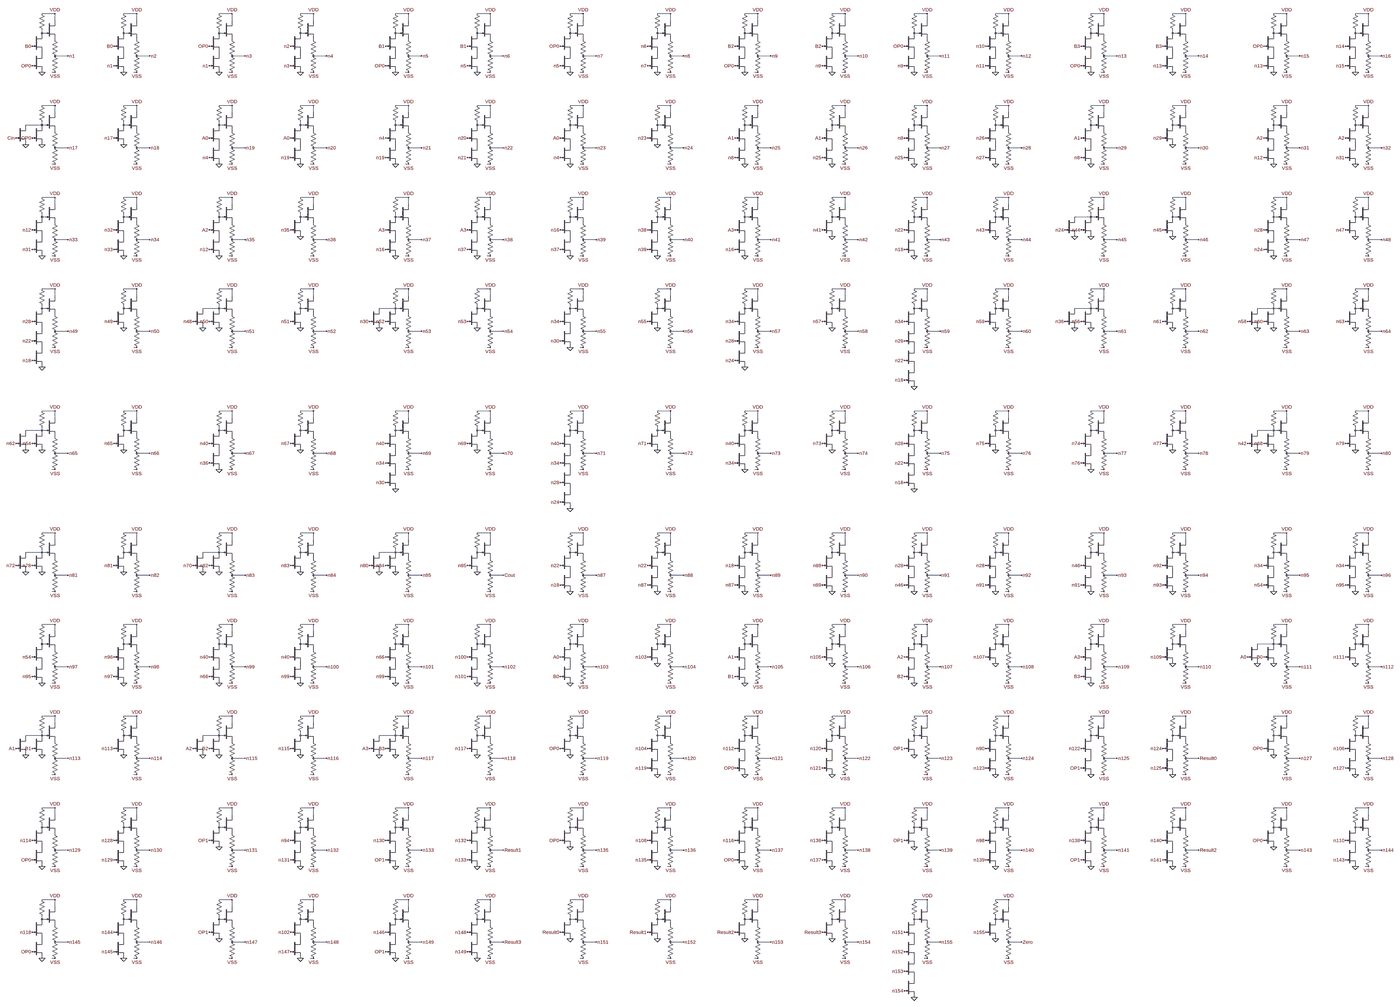
[diagram p0: schematic alu_4bit.asc, whole sheet]
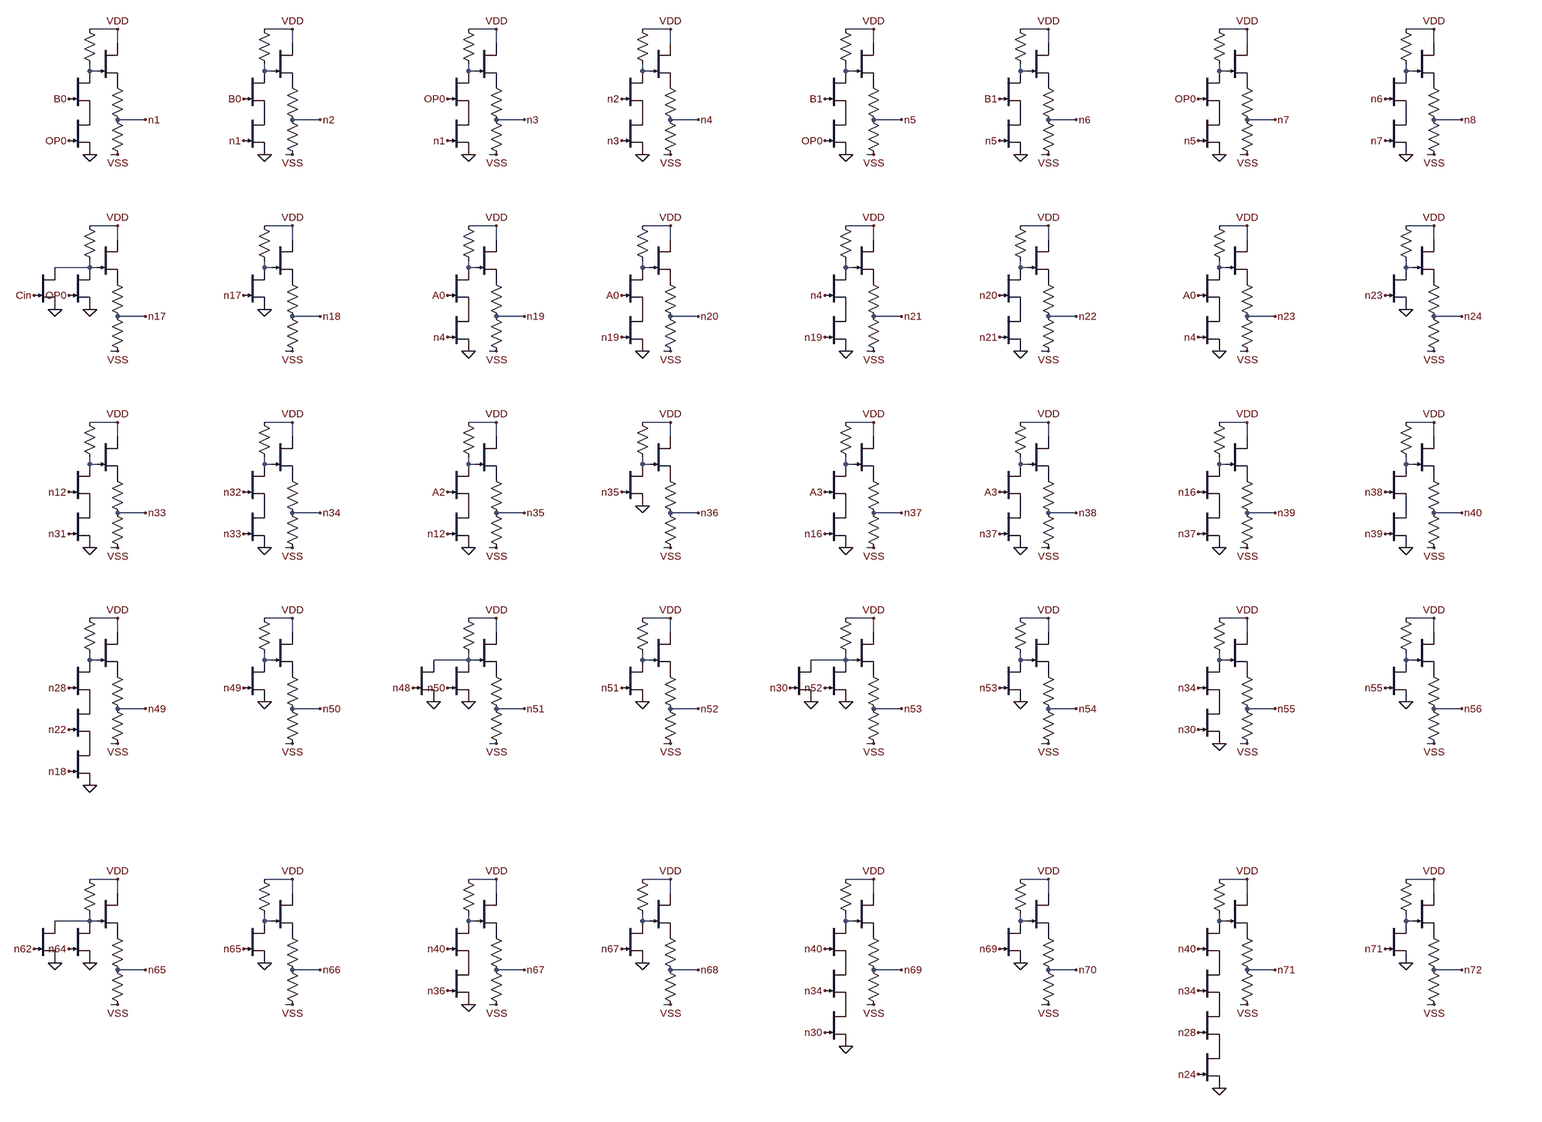
[diagram p1: schematic alu_4bit.asc, part, row 1 of 2, column 1 of 2]
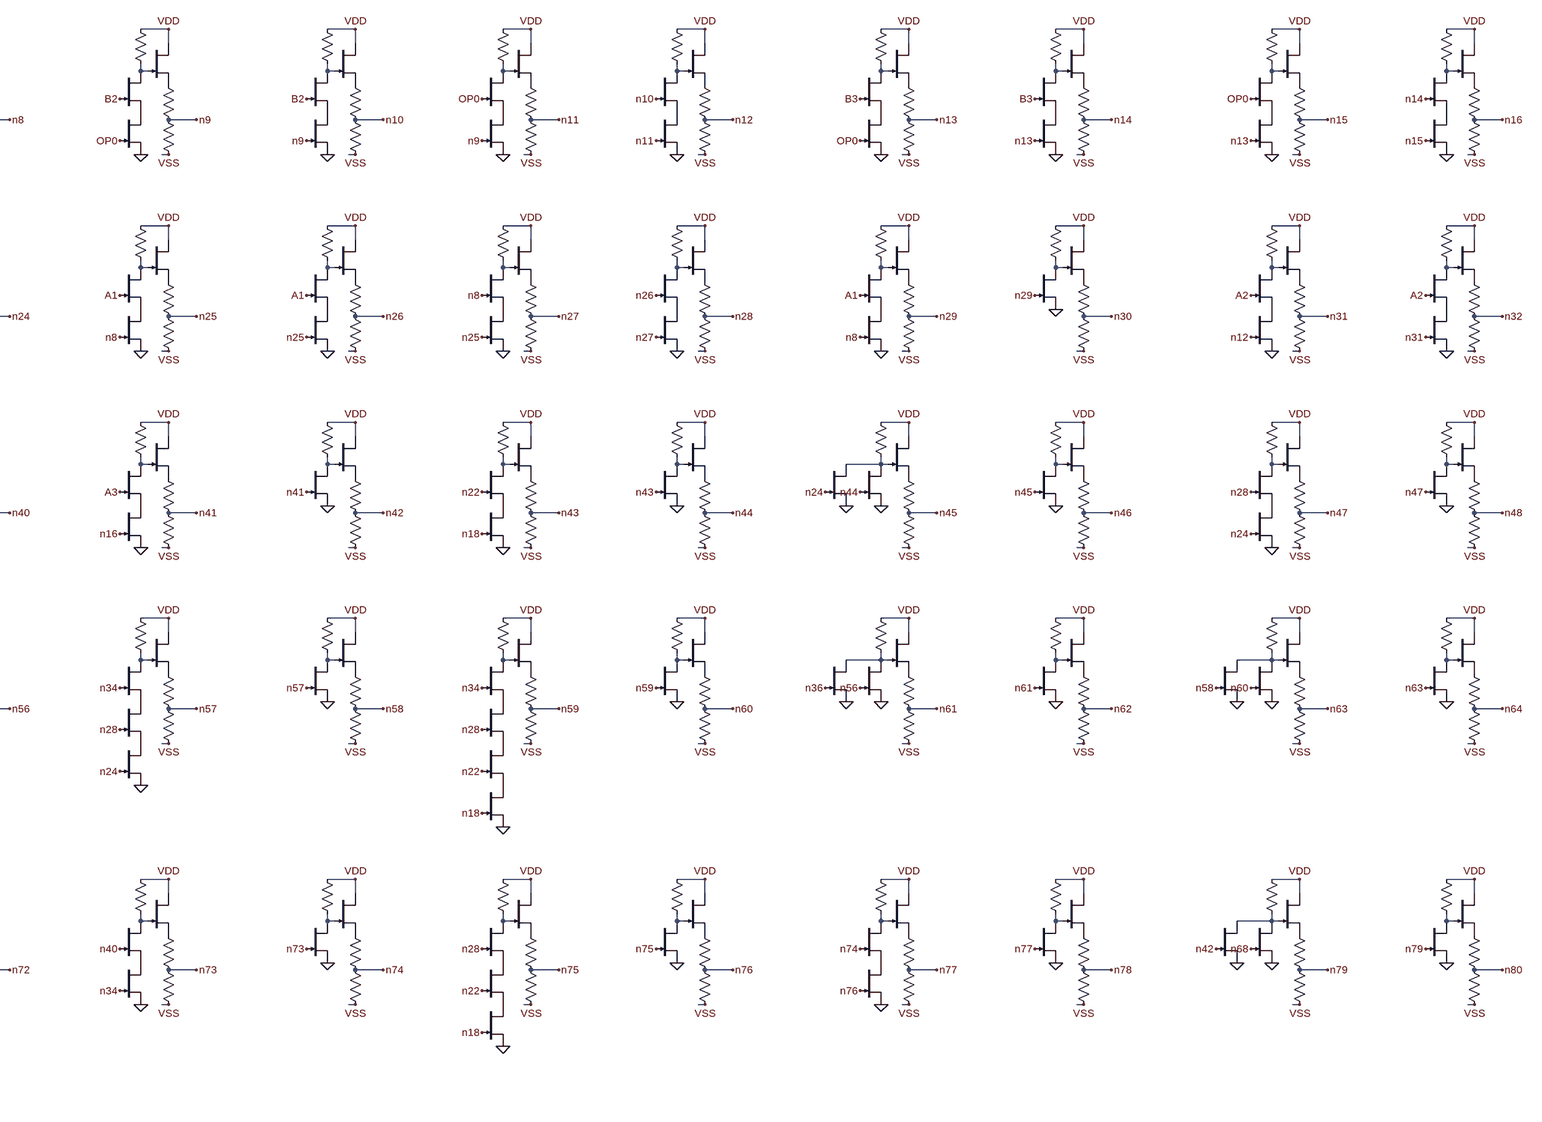
[diagram p2: schematic alu_4bit.asc, part, row 1 of 2, column 2 of 2]
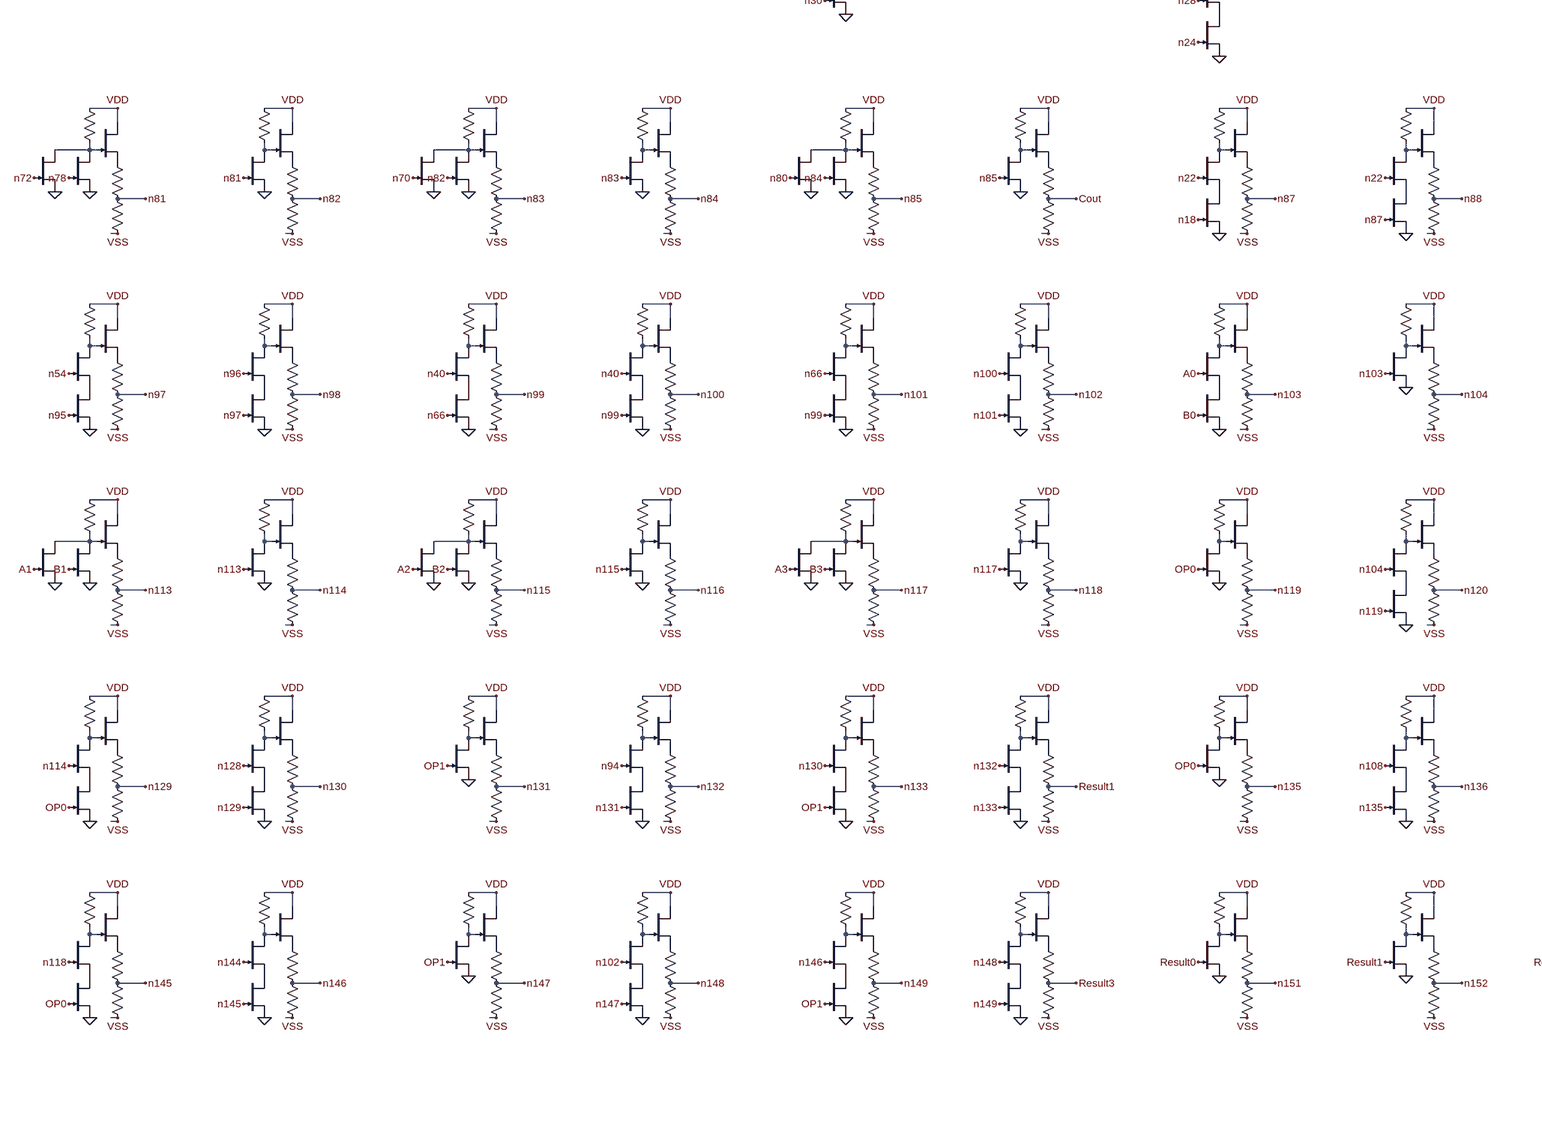
[diagram p3: schematic alu_4bit.asc, part, row 2 of 2, column 1 of 2]
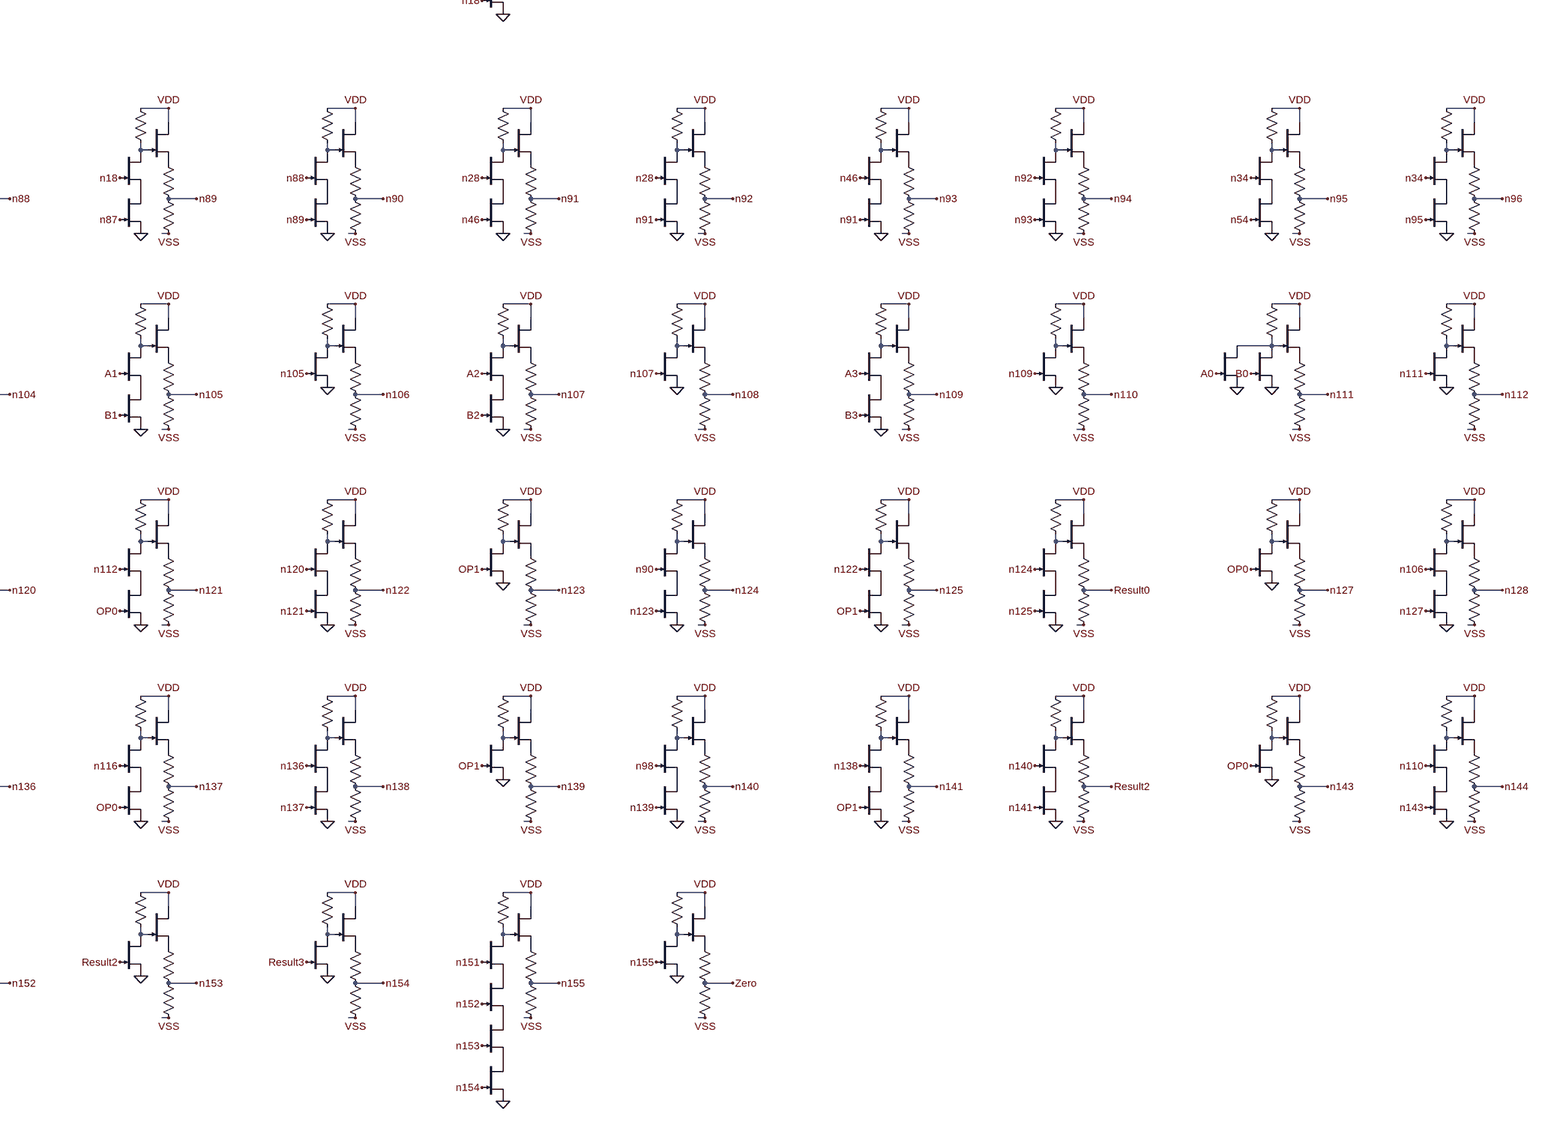
[diagram p4: schematic alu_4bit.asc, part, row 2 of 2, column 2 of 2]
* alu_4bit.asc
R1 VDD N001 100k
J_F1 VDD N001 P001 DR
R2 P001 n1 1k
R3 n1 VSS 4.8k
J_B1 N001 B0 P002 DR
J_A1 P002 OP0 0 DR
R4 VDD N002 100k
J_F2 VDD N002 P003 DR
R5 P003 n2 1k
R6 n2 VSS 4.8k
J_B2 N002 B0 P004 DR
J_A2 P004 n1 0 DR
R7 VDD N003 100k
J_F3 VDD N003 P005 DR
R8 P005 n3 1k
R9 n3 VSS 4.8k
J_B3 N003 OP0 P006 DR
J_A3 P006 n1 0 DR
R10 VDD N004 100k
J_F4 VDD N004 P007 DR
R11 P007 n4 1k
R12 n4 VSS 4.8k
J_B4 N004 n2 P008 DR
J_A4 P008 n3 0 DR
R13 VDD N005 100k
J_F5 VDD N005 P009 DR
R14 P009 n5 1k
R15 n5 VSS 4.8k
J_B5 N005 B1 P010 DR
J_A5 P010 OP0 0 DR
R16 VDD N006 100k
J_F6 VDD N006 P011 DR
R17 P011 n6 1k
R18 n6 VSS 4.8k
J_B6 N006 B1 P012 DR
J_A6 P012 n5 0 DR
R19 VDD N007 100k
J_F7 VDD N007 P013 DR
R20 P013 n7 1k
R21 n7 VSS 4.8k
J_B7 N007 OP0 P014 DR
J_A7 P014 n5 0 DR
R22 VDD N008 100k
J_F8 VDD N008 P015 DR
R23 P015 n8 1k
R24 n8 VSS 4.8k
J_B8 N008 n6 P016 DR
J_A8 P016 n7 0 DR
R25 VDD N009 100k
J_F9 VDD N009 P017 DR
R26 P017 n9 1k
R27 n9 VSS 4.8k
J_B9 N009 B2 P018 DR
J_A9 P018 OP0 0 DR
R28 VDD N010 100k
J_F10 VDD N010 P019 DR
R29 P019 n10 1k
R30 n10 VSS 4.8k
J_B10 N010 B2 P020 DR
J_A10 P020 n9 0 DR
R31 VDD N011 100k
J_F11 VDD N011 P021 DR
R32 P021 n11 1k
R33 n11 VSS 4.8k
J_B11 N011 OP0 P022 DR
J_A11 P022 n9 0 DR
R34 VDD N012 100k
J_F12 VDD N012 P023 DR
R35 P023 n12 1k
R36 n12 VSS 4.8k
J_B12 N012 n10 P024 DR
J_A12 P024 n11 0 DR
R37 VDD N013 100k
J_F13 VDD N013 P025 DR
R38 P025 n13 1k
R39 n13 VSS 4.8k
J_B13 N013 B3 P026 DR
J_A13 P026 OP0 0 DR
R40 VDD N014 100k
J_F14 VDD N014 P027 DR
R41 P027 n14 1k
R42 n14 VSS 4.8k
J_B14 N014 B3 P028 DR
J_A14 P028 n13 0 DR
R43 VDD N015 100k
J_F15 VDD N015 P029 DR
R44 P029 n15 1k
R45 n15 VSS 4.8k
J_B15 N015 OP0 P030 DR
J_A15 P030 n13 0 DR
R46 VDD N016 100k
J_F16 VDD N016 P031 DR
R47 P031 n16 1k
R48 n16 VSS 4.8k
J_B16 N016 n14 P032 DR
J_A16 P032 n15 0 DR
R49 VDD N017 100k
J_F17 VDD N017 P033 DR
R50 P033 n17 1k
R51 n17 VSS 4.8k
J_B17 N017 OP0 0 DR
J_B18 N017 Cin 0 DR
R52 VDD N018 100k
J_F18 VDD N018 P034 DR
R53 P034 n18 1k
R54 n18 VSS 4.8k
J_B19 N018 n17 0 DR
R55 VDD N019 100k
J_F19 VDD N019 P035 DR
R56 P035 n19 1k
R57 n19 VSS 4.8k
J_B20 N019 A0 P036 DR
J_A17 P036 n4 0 DR
R58 VDD N020 100k
J_F20 VDD N020 P037 DR
R59 P037 n20 1k
R60 n20 VSS 4.8k
J_B21 N020 A0 P038 DR
J_A18 P038 n19 0 DR
R61 VDD N021 100k
J_F21 VDD N021 P039 DR
R62 P039 n21 1k
R63 n21 VSS 4.8k
J_B22 N021 n4 P040 DR
J_A19 P040 n19 0 DR
R64 VDD N022 100k
J_F22 VDD N022 P041 DR
R65 P041 n22 1k
R66 n22 VSS 4.8k
J_B23 N022 n20 P042 DR
J_A20 P042 n21 0 DR
R67 VDD N023 100k
J_F23 VDD N023 P043 DR
R68 P043 n23 1k
R69 n23 VSS 4.8k
J_B24 N023 A0 P044 DR
J_A21 P044 n4 0 DR
R70 VDD N024 100k
J_F24 VDD N024 P045 DR
R71 P045 n24 1k
R72 n24 VSS 4.8k
J_B25 N024 n23 0 DR
R73 VDD N025 100k
J_F25 VDD N025 P046 DR
R74 P046 n25 1k
R75 n25 VSS 4.8k
J_B26 N025 A1 P047 DR
J_A22 P047 n8 0 DR
R76 VDD N026 100k
J_F26 VDD N026 P048 DR
R77 P048 n26 1k
R78 n26 VSS 4.8k
J_B27 N026 A1 P049 DR
J_A23 P049 n25 0 DR
R79 VDD N027 100k
J_F27 VDD N027 P050 DR
R80 P050 n27 1k
R81 n27 VSS 4.8k
J_B28 N027 n8 P051 DR
J_A24 P051 n25 0 DR
R82 VDD N028 100k
J_F28 VDD N028 P052 DR
R83 P052 n28 1k
R84 n28 VSS 4.8k
J_B29 N028 n26 P053 DR
J_A25 P053 n27 0 DR
R85 VDD N029 100k
J_F29 VDD N029 P054 DR
R86 P054 n29 1k
R87 n29 VSS 4.8k
J_B30 N029 A1 P055 DR
J_A26 P055 n8 0 DR
R88 VDD N030 100k
J_F30 VDD N030 P056 DR
R89 P056 n30 1k
R90 n30 VSS 4.8k
J_B31 N030 n29 0 DR
R91 VDD N031 100k
J_F31 VDD N031 P057 DR
R92 P057 n31 1k
R93 n31 VSS 4.8k
J_B32 N031 A2 P058 DR
J_A27 P058 n12 0 DR
R94 VDD N032 100k
J_F32 VDD N032 P059 DR
R95 P059 n32 1k
R96 n32 VSS 4.8k
J_B33 N032 A2 P060 DR
J_A28 P060 n31 0 DR
R97 VDD N033 100k
J_F33 VDD N033 P061 DR
R98 P061 n33 1k
R99 n33 VSS 4.8k
J_B34 N033 n12 P062 DR
J_A29 P062 n31 0 DR
R100 VDD N034 100k
J_F34 VDD N034 P063 DR
R101 P063 n34 1k
R102 n34 VSS 4.8k
J_B35 N034 n32 P064 DR
J_A30 P064 n33 0 DR
R103 VDD N035 100k
J_F35 VDD N035 P065 DR
R104 P065 n35 1k
R105 n35 VSS 4.8k
J_B36 N035 A2 P066 DR
J_A31 P066 n12 0 DR
R106 VDD N036 100k
J_F36 VDD N036 P067 DR
R107 P067 n36 1k
R108 n36 VSS 4.8k
J_B37 N036 n35 0 DR
R109 VDD N037 100k
J_F37 VDD N037 P068 DR
R110 P068 n37 1k
R111 n37 VSS 4.8k
J_B38 N037 A3 P069 DR
J_A32 P069 n16 0 DR
R112 VDD N038 100k
J_F38 VDD N038 P070 DR
R113 P070 n38 1k
R114 n38 VSS 4.8k
J_B39 N038 A3 P071 DR
J_A33 P071 n37 0 DR
R115 VDD N039 100k
J_F39 VDD N039 P072 DR
R116 P072 n39 1k
R117 n39 VSS 4.8k
J_B40 N039 n16 P073 DR
J_A34 P073 n37 0 DR
R118 VDD N040 100k
J_F40 VDD N040 P074 DR
R119 P074 n40 1k
R120 n40 VSS 4.8k
J_B41 N040 n38 P075 DR
J_A35 P075 n39 0 DR
R121 VDD N041 100k
J_F41 VDD N041 P076 DR
R122 P076 n41 1k
R123 n41 VSS 4.8k
J_B42 N041 A3 P077 DR
J_A36 P077 n16 0 DR
R124 VDD N042 100k
J_F42 VDD N042 P078 DR
R125 P078 n42 1k
R126 n42 VSS 4.8k
J_B43 N042 n41 0 DR
R127 VDD N043 100k
J_F43 VDD N043 P079 DR
R128 P079 n43 1k
R129 n43 VSS 4.8k
J_B44 N043 n22 P080 DR
J_A37 P080 n18 0 DR
R130 VDD N044 100k
J_F44 VDD N044 P081 DR
R131 P081 n44 1k
R132 n44 VSS 4.8k
J_B45 N044 n43 0 DR
R133 VDD N045 100k
J_F45 VDD N045 P082 DR
R134 P082 n45 1k
R135 n45 VSS 4.8k
J_B46 N045 n44 0 DR
J_B47 N045 n24 0 DR
R136 VDD N046 100k
J_F46 VDD N046 P083 DR
R137 P083 n46 1k
R138 n46 VSS 4.8k
J_B48 N046 n45 0 DR
R139 VDD N047 100k
J_F47 VDD N047 P084 DR
R140 P084 n47 1k
R141 n47 VSS 4.8k
J_B49 N047 n28 P085 DR
J_A38 P085 n24 0 DR
R142 VDD N048 100k
J_F48 VDD N048 P086 DR
R143 P086 n48 1k
R144 n48 VSS 4.8k
J_B50 N048 n47 0 DR
R145 VDD N049 100k
J_F49 VDD N049 P087 DR
R146 P087 n49 1k
R147 n49 VSS 4.8k
J_B51 N049 n28 P088 DR
J_A39 P088 n22 P089 DR
J_A40 P089 n18 0 DR
R148 VDD N050 100k
J_F50 VDD N050 P090 DR
R149 P090 n50 1k
R150 n50 VSS 4.8k
J_B52 N050 n49 0 DR
R151 VDD N051 100k
J_F51 VDD N051 P091 DR
R152 P091 n51 1k
R153 n51 VSS 4.8k
J_B53 N051 n50 0 DR
J_B54 N051 n48 0 DR
R154 VDD N052 100k
J_F52 VDD N052 P092 DR
R155 P092 n52 1k
R156 n52 VSS 4.8k
J_B55 N052 n51 0 DR
R157 VDD N053 100k
J_F53 VDD N053 P093 DR
R158 P093 n53 1k
R159 n53 VSS 4.8k
J_B56 N053 n52 0 DR
J_B57 N053 n30 0 DR
R160 VDD N054 100k
J_F54 VDD N054 P094 DR
R161 P094 n54 1k
R162 n54 VSS 4.8k
J_B58 N054 n53 0 DR
R163 VDD N055 100k
J_F55 VDD N055 P095 DR
R164 P095 n55 1k
R165 n55 VSS 4.8k
J_B59 N055 n34 P096 DR
J_A41 P096 n30 0 DR
R166 VDD N056 100k
J_F56 VDD N056 P097 DR
R167 P097 n56 1k
R168 n56 VSS 4.8k
J_B60 N056 n55 0 DR
R169 VDD N057 100k
J_F57 VDD N057 P098 DR
R170 P098 n57 1k
R171 n57 VSS 4.8k
J_B61 N057 n34 P099 DR
J_A42 P099 n28 P100 DR
J_A43 P100 n24 0 DR
R172 VDD N058 100k
J_F58 VDD N058 P101 DR
R173 P101 n58 1k
R174 n58 VSS 4.8k
J_B62 N058 n57 0 DR
R175 VDD N059 100k
J_F59 VDD N059 P102 DR
R176 P102 n59 1k
R177 n59 VSS 4.8k
J_B63 N059 n34 P103 DR
J_A44 P103 n28 P104 DR
J_A45 P104 n22 P105 DR
J_A46 P105 n18 0 DR
R178 VDD N060 100k
J_F60 VDD N060 P106 DR
R179 P106 n60 1k
R180 n60 VSS 4.8k
J_B64 N060 n59 0 DR
R181 VDD N061 100k
J_F61 VDD N061 P107 DR
R182 P107 n61 1k
R183 n61 VSS 4.8k
J_B65 N061 n56 0 DR
J_B66 N061 n36 0 DR
R184 VDD N062 100k
J_F62 VDD N062 P108 DR
R185 P108 n62 1k
R186 n62 VSS 4.8k
J_B67 N062 n61 0 DR
R187 VDD N063 100k
J_F63 VDD N063 P109 DR
R188 P109 n63 1k
R189 n63 VSS 4.8k
J_B68 N063 n60 0 DR
J_B69 N063 n58 0 DR
R190 VDD N064 100k
J_F64 VDD N064 P110 DR
R191 P110 n64 1k
R192 n64 VSS 4.8k
J_B70 N064 n63 0 DR
R193 VDD N065 100k
J_F65 VDD N065 P111 DR
R194 P111 n65 1k
R195 n65 VSS 4.8k
J_B71 N065 n64 0 DR
J_B72 N065 n62 0 DR
R196 VDD N066 100k
J_F66 VDD N066 P112 DR
R197 P112 n66 1k
R198 n66 VSS 4.8k
J_B73 N066 n65 0 DR
R199 VDD N067 100k
J_F67 VDD N067 P113 DR
R200 P113 n67 1k
R201 n67 VSS 4.8k
J_B74 N067 n40 P114 DR
J_A47 P114 n36 0 DR
R202 VDD N068 100k
J_F68 VDD N068 P115 DR
R203 P115 n68 1k
R204 n68 VSS 4.8k
J_B75 N068 n67 0 DR
R205 VDD N069 100k
J_F69 VDD N069 P116 DR
R206 P116 n69 1k
R207 n69 VSS 4.8k
J_B76 N069 n40 P117 DR
J_A48 P117 n34 P118 DR
J_A49 P118 n30 0 DR
R208 VDD N070 100k
J_F70 VDD N070 P119 DR
R209 P119 n70 1k
R210 n70 VSS 4.8k
J_B77 N070 n69 0 DR
R211 VDD N071 100k
J_F71 VDD N071 P120 DR
R212 P120 n71 1k
R213 n71 VSS 4.8k
J_B78 N071 n40 P121 DR
J_A50 P121 n34 P122 DR
J_A51 P122 n28 P123 DR
J_A52 P123 n24 0 DR
R214 VDD N072 100k
J_F72 VDD N072 P124 DR
R215 P124 n72 1k
R216 n72 VSS 4.8k
J_B79 N072 n71 0 DR
R217 VDD N073 100k
J_F73 VDD N073 P125 DR
R218 P125 n73 1k
R219 n73 VSS 4.8k
J_B80 N073 n40 P126 DR
J_A53 P126 n34 0 DR
R220 VDD N074 100k
J_F74 VDD N074 P127 DR
R221 P127 n74 1k
R222 n74 VSS 4.8k
J_B81 N074 n73 0 DR
R223 VDD N075 100k
J_F75 VDD N075 P128 DR
R224 P128 n75 1k
R225 n75 VSS 4.8k
J_B82 N075 n28 P129 DR
J_A54 P129 n22 P130 DR
J_A55 P130 n18 0 DR
R226 VDD N076 100k
J_F76 VDD N076 P131 DR
R227 P131 n76 1k
R228 n76 VSS 4.8k
J_B83 N076 n75 0 DR
R229 VDD N077 100k
J_F77 VDD N077 P132 DR
R230 P132 n77 1k
R231 n77 VSS 4.8k
J_B84 N077 n74 P133 DR
J_A56 P133 n76 0 DR
R232 VDD N078 100k
J_F78 VDD N078 P134 DR
R233 P134 n78 1k
R234 n78 VSS 4.8k
J_B85 N078 n77 0 DR
R235 VDD N079 100k
J_F79 VDD N079 P135 DR
R236 P135 n79 1k
R237 n79 VSS 4.8k
J_B86 N079 n68 0 DR
J_B87 N079 n42 0 DR
R238 VDD N080 100k
J_F80 VDD N080 P136 DR
R239 P136 n80 1k
R240 n80 VSS 4.8k
J_B88 N080 n79 0 DR
R241 VDD N081 100k
J_F81 VDD N081 P137 DR
R242 P137 n81 1k
R243 n81 VSS 4.8k
J_B89 N081 n78 0 DR
J_B90 N081 n72 0 DR
R244 VDD N082 100k
J_F82 VDD N082 P138 DR
R245 P138 n82 1k
R246 n82 VSS 4.8k
J_B91 N082 n81 0 DR
R247 VDD N083 100k
J_F83 VDD N083 P139 DR
R248 P139 n83 1k
R249 n83 VSS 4.8k
J_B92 N083 n82 0 DR
J_B93 N083 n70 0 DR
R250 VDD N084 100k
J_F84 VDD N084 P140 DR
R251 P140 n84 1k
R252 n84 VSS 4.8k
J_B94 N084 n83 0 DR
R253 VDD N085 100k
J_F85 VDD N085 P141 DR
R254 P141 n85 1k
R255 n85 VSS 4.8k
J_B95 N085 n84 0 DR
J_B96 N085 n80 0 DR
R256 VDD N086 100k
J_F86 VDD N086 P142 DR
R257 P142 Cout 1k
R258 Cout VSS 4.8k
J_B97 N086 n85 0 DR
R259 VDD N087 100k
J_F87 VDD N087 P143 DR
R260 P143 n87 1k
R261 n87 VSS 4.8k
J_B98 N087 n22 P144 DR
J_A57 P144 n18 0 DR
R262 VDD N088 100k
J_F88 VDD N088 P145 DR
R263 P145 n88 1k
R264 n88 VSS 4.8k
J_B99 N088 n22 P146 DR
J_A58 P146 n87 0 DR
R265 VDD N089 100k
J_F89 VDD N089 P147 DR
R266 P147 n89 1k
R267 n89 VSS 4.8k
J_B100 N089 n18 P148 DR
J_A59 P148 n87 0 DR
R268 VDD N090 100k
J_F90 VDD N090 P149 DR
R269 P149 n90 1k
R270 n90 VSS 4.8k
J_B101 N090 n88 P150 DR
J_A60 P150 n89 0 DR
R271 VDD N091 100k
J_F91 VDD N091 P151 DR
R272 P151 n91 1k
R273 n91 VSS 4.8k
J_B102 N091 n28 P152 DR
J_A61 P152 n46 0 DR
R274 VDD N092 100k
J_F92 VDD N092 P153 DR
R275 P153 n92 1k
R276 n92 VSS 4.8k
J_B103 N092 n28 P154 DR
J_A62 P154 n91 0 DR
R277 VDD N093 100k
J_F93 VDD N093 P155 DR
R278 P155 n93 1k
R279 n93 VSS 4.8k
J_B104 N093 n46 P156 DR
J_A63 P156 n91 0 DR
R280 VDD N094 100k
J_F94 VDD N094 P157 DR
R281 P157 n94 1k
R282 n94 VSS 4.8k
J_B105 N094 n92 P158 DR
J_A64 P158 n93 0 DR
R283 VDD N095 100k
J_F95 VDD N095 P159 DR
R284 P159 n95 1k
R285 n95 VSS 4.8k
J_B106 N095 n34 P160 DR
J_A65 P160 n54 0 DR
R286 VDD N096 100k
J_F96 VDD N096 P161 DR
R287 P161 n96 1k
R288 n96 VSS 4.8k
J_B107 N096 n34 P162 DR
J_A66 P162 n95 0 DR
R289 VDD N097 100k
J_F97 VDD N097 P163 DR
R290 P163 n97 1k
R291 n97 VSS 4.8k
J_B108 N097 n54 P164 DR
J_A67 P164 n95 0 DR
R292 VDD N098 100k
J_F98 VDD N098 P165 DR
R293 P165 n98 1k
R294 n98 VSS 4.8k
J_B109 N098 n96 P166 DR
J_A68 P166 n97 0 DR
R295 VDD N099 100k
J_F99 VDD N099 P167 DR
R296 P167 n99 1k
R297 n99 VSS 4.8k
J_B110 N099 n40 P168 DR
J_A69 P168 n66 0 DR
R298 VDD N126 100k
J_F100 VDD N126 P169 DR
R299 P169 n100 1k
R300 n100 VSS 4.8k
J_B111 N126 n40 P170 DR
J_A70 P170 n99 0 DR
R301 VDD N134 100k
J_F101 VDD N134 P171 DR
R302 P171 n101 1k
R303 n101 VSS 4.8k
J_B112 N134 n66 P172 DR
J_A71 P172 n99 0 DR
R304 VDD N142 100k
J_F102 VDD N142 P173 DR
R305 P173 n102 1k
R306 n102 VSS 4.8k
J_B113 N142 n100 P174 DR
J_A72 P174 n101 0 DR
R307 VDD N150 100k
J_F103 VDD N150 P175 DR
R308 P175 n103 1k
R309 n103 VSS 4.8k
J_B114 N150 A0 P176 DR
J_A73 P176 B0 0 DR
R310 VDD N156 100k
J_F104 VDD N156 P177 DR
R311 P177 n104 1k
R312 n104 VSS 4.8k
J_B115 N156 n103 0 DR
R313 VDD N157 100k
J_F105 VDD N157 P178 DR
R314 P178 n105 1k
R315 n105 VSS 4.8k
J_B116 N157 A1 P179 DR
J_A74 P179 B1 0 DR
R316 VDD N158 100k
J_F106 VDD N158 P180 DR
R317 P180 n106 1k
R318 n106 VSS 4.8k
J_B117 N158 n105 0 DR
R319 VDD N159 100k
J_F107 VDD N159 P181 DR
R320 P181 n107 1k
R321 n107 VSS 4.8k
J_B118 N159 A2 P182 DR
J_A75 P182 B2 0 DR
R322 VDD N160 100k
J_F108 VDD N160 P183 DR
R323 P183 n108 1k
R324 n108 VSS 4.8k
J_B119 N160 n107 0 DR
R325 VDD N161 100k
J_F109 VDD N161 P184 DR
R326 P184 n109 1k
R327 n109 VSS 4.8k
J_B120 N161 A3 P185 DR
J_A76 P185 B3 0 DR
R328 VDD N162 100k
J_F110 VDD N162 P186 DR
R329 P186 n110 1k
R330 n110 VSS 4.8k
J_B121 N162 n109 0 DR
R331 VDD N163 100k
J_F111 VDD N163 P187 DR
R332 P187 n111 1k
R333 n111 VSS 4.8k
J_B122 N163 B0 0 DR
J_B123 N163 A0 0 DR
R334 VDD N164 100k
J_F112 VDD N164 P188 DR
R335 P188 n112 1k
R336 n112 VSS 4.8k
J_B124 N164 n111 0 DR
R337 VDD N165 100k
J_F113 VDD N165 P189 DR
R338 P189 n113 1k
R339 n113 VSS 4.8k
J_B125 N165 B1 0 DR
J_B126 N165 A1 0 DR
R340 VDD N166 100k
J_F114 VDD N166 P190 DR
R341 P190 n114 1k
R342 n114 VSS 4.8k
J_B127 N166 n113 0 DR
R343 VDD N167 100k
J_F115 VDD N167 P191 DR
R344 P191 n115 1k
R345 n115 VSS 4.8k
J_B128 N167 B2 0 DR
J_B129 N167 A2 0 DR
R346 VDD N168 100k
J_F116 VDD N168 P192 DR
R347 P192 n116 1k
R348 n116 VSS 4.8k
J_B130 N168 n115 0 DR
R349 VDD N169 100k
J_F117 VDD N169 P193 DR
R350 P193 n117 1k
R351 n117 VSS 4.8k
J_B131 N169 B3 0 DR
J_B132 N169 A3 0 DR
R352 VDD N170 100k
J_F118 VDD N170 P194 DR
R353 P194 n118 1k
R354 n118 VSS 4.8k
J_B133 N170 n117 0 DR
R355 VDD N171 100k
J_F119 VDD N171 P195 DR
R356 P195 n119 1k
R357 n119 VSS 4.8k
J_B134 N171 OP0 0 DR
R358 VDD N172 100k
J_F120 VDD N172 P196 DR
R359 P196 n120 1k
R360 n120 VSS 4.8k
J_B135 N172 n104 P197 DR
J_A77 P197 n119 0 DR
R361 VDD N173 100k
J_F121 VDD N173 P198 DR
R362 P198 n121 1k
R363 n121 VSS 4.8k
J_B136 N173 n112 P199 DR
J_A78 P199 OP0 0 DR
R364 VDD N174 100k
J_F122 VDD N174 P200 DR
R365 P200 n122 1k
R366 n122 VSS 4.8k
J_B137 N174 n120 P201 DR
J_A79 P201 n121 0 DR
R367 VDD N175 100k
J_F123 VDD N175 P202 DR
R368 P202 n123 1k
R369 n123 VSS 4.8k
J_B138 N175 OP1 0 DR
R370 VDD N176 100k
J_F124 VDD N176 P203 DR
R371 P203 n124 1k
R372 n124 VSS 4.8k
J_B139 N176 n90 P204 DR
J_A80 P204 n123 0 DR
R373 VDD N177 100k
J_F125 VDD N177 P205 DR
R374 P205 n125 1k
R375 n125 VSS 4.8k
J_B140 N177 n122 P206 DR
J_A81 P206 OP1 0 DR
R376 VDD N178 100k
J_F126 VDD N178 P207 DR
R377 P207 Result0 1k
R378 Result0 VSS 4.8k
J_B141 N178 n124 P208 DR
J_A82 P208 n125 0 DR
R379 VDD N179 100k
J_F127 VDD N179 P209 DR
R380 P209 n127 1k
R381 n127 VSS 4.8k
J_B142 N179 OP0 0 DR
R382 VDD N180 100k
J_F128 VDD N180 P210 DR
R383 P210 n128 1k
R384 n128 VSS 4.8k
J_B143 N180 n106 P211 DR
J_A83 P211 n127 0 DR
R385 VDD N181 100k
J_F129 VDD N181 P212 DR
R386 P212 n129 1k
R387 n129 VSS 4.8k
J_B144 N181 n114 P213 DR
J_A84 P213 OP0 0 DR
R388 VDD N182 100k
J_F130 VDD N182 P214 DR
R389 P214 n130 1k
R390 n130 VSS 4.8k
J_B145 N182 n128 P215 DR
J_A85 P215 n129 0 DR
R391 VDD N183 100k
J_F131 VDD N183 P216 DR
R392 P216 n131 1k
R393 n131 VSS 4.8k
J_B146 N183 OP1 0 DR
R394 VDD N184 100k
J_F132 VDD N184 P217 DR
R395 P217 n132 1k
R396 n132 VSS 4.8k
J_B147 N184 n94 P218 DR
J_A86 P218 n131 0 DR
R397 VDD N185 100k
J_F133 VDD N185 P219 DR
R398 P219 n133 1k
R399 n133 VSS 4.8k
J_B148 N185 n130 P220 DR
J_A87 P220 OP1 0 DR
R400 VDD N186 100k
J_F134 VDD N186 P221 DR
R401 P221 Result1 1k
R402 Result1 VSS 4.8k
J_B149 N186 n132 P222 DR
J_A88 P222 n133 0 DR
R403 VDD N187 100k
J_F135 VDD N187 P223 DR
R404 P223 n135 1k
R405 n135 VSS 4.8k
J_B150 N187 OP0 0 DR
R406 VDD N188 100k
J_F136 VDD N188 P224 DR
R407 P224 n136 1k
R408 n136 VSS 4.8k
J_B151 N188 n108 P225 DR
J_A89 P225 n135 0 DR
R409 VDD N189 100k
J_F137 VDD N189 P226 DR
R410 P226 n137 1k
R411 n137 VSS 4.8k
J_B152 N189 n116 P227 DR
J_A90 P227 OP0 0 DR
R412 VDD N190 100k
J_F138 VDD N190 P228 DR
R413 P228 n138 1k
R414 n138 VSS 4.8k
J_B153 N190 n136 P229 DR
J_A91 P229 n137 0 DR
R415 VDD N191 100k
J_F139 VDD N191 P230 DR
R416 P230 n139 1k
R417 n139 VSS 4.8k
J_B154 N191 OP1 0 DR
R418 VDD N192 100k
J_F140 VDD N192 P231 DR
R419 P231 n140 1k
R420 n140 VSS 4.8k
J_B155 N192 n98 P232 DR
J_A92 P232 n139 0 DR
R421 VDD N193 100k
J_F141 VDD N193 P233 DR
R422 P233 n141 1k
R423 n141 VSS 4.8k
J_B156 N193 n138 P234 DR
J_A93 P234 OP1 0 DR
R424 VDD N194 100k
J_F142 VDD N194 P235 DR
R425 P235 Result2 1k
R426 Result2 VSS 4.8k
J_B157 N194 n140 P236 DR
J_A94 P236 n141 0 DR
R427 VDD N195 100k
J_F143 VDD N195 P237 DR
R428 P237 n143 1k
R429 n143 VSS 4.8k
J_B158 N195 OP0 0 DR
R430 VDD N196 100k
J_F144 VDD N196 P238 DR
R431 P238 n144 1k
R432 n144 VSS 4.8k
J_B159 N196 n110 P239 DR
J_A95 P239 n143 0 DR
R433 VDD N197 100k
J_F145 VDD N197 P240 DR
R434 P240 n145 1k
R435 n145 VSS 4.8k
J_B160 N197 n118 P241 DR
J_A96 P241 OP0 0 DR
R436 VDD N198 100k
J_F146 VDD N198 P242 DR
R437 P242 n146 1k
R438 n146 VSS 4.8k
J_B161 N198 n144 P243 DR
J_A97 P243 n145 0 DR
R439 VDD N199 100k
J_F147 VDD N199 P244 DR
R440 P244 n147 1k
R441 n147 VSS 4.8k
J_B162 N199 OP1 0 DR
R442 VDD N200 100k
J_F148 VDD N200 P245 DR
R443 P245 n148 1k
R444 n148 VSS 4.8k
J_B163 N200 n102 P246 DR
J_A98 P246 n147 0 DR
R445 VDD N201 100k
J_F149 VDD N201 P247 DR
R446 P247 n149 1k
R447 n149 VSS 4.8k
J_B164 N201 n146 P248 DR
J_A99 P248 OP1 0 DR
R448 VDD N202 100k
J_F150 VDD N202 P249 DR
R449 P249 Result3 1k
R450 Result3 VSS 4.8k
J_B165 N202 n148 P250 DR
J_A100 P250 n149 0 DR
R451 VDD N203 100k
J_F151 VDD N203 P251 DR
R452 P251 n151 1k
R453 n151 VSS 4.8k
J_B166 N203 Result0 0 DR
R454 VDD N204 100k
J_F152 VDD N204 P252 DR
R455 P252 n152 1k
R456 n152 VSS 4.8k
J_B167 N204 Result1 0 DR
R457 VDD N205 100k
J_F153 VDD N205 P253 DR
R458 P253 n153 1k
R459 n153 VSS 4.8k
J_B168 N205 Result2 0 DR
R460 VDD N206 100k
J_F154 VDD N206 P254 DR
R461 P254 n154 1k
R462 n154 VSS 4.8k
J_B169 N206 Result3 0 DR
R463 VDD N207 100k
J_F155 VDD N207 P255 DR
R464 P255 n155 1k
R465 n155 VSS 4.8k
J_B170 N207 n151 P256 DR
J_A101 P256 n152 P257 DR
J_A102 P257 n153 P258 DR
J_A103 P258 n154 0 DR
R466 VDD N208 100k
J_F156 VDD N208 P259 DR
R467 P259 Zero 1k
R468 Zero VSS 4.8k
J_B171 N208 n155 0 DR
.model NJF NJF
.model PJF PJF
.lib standard.jft
.backanno
.end